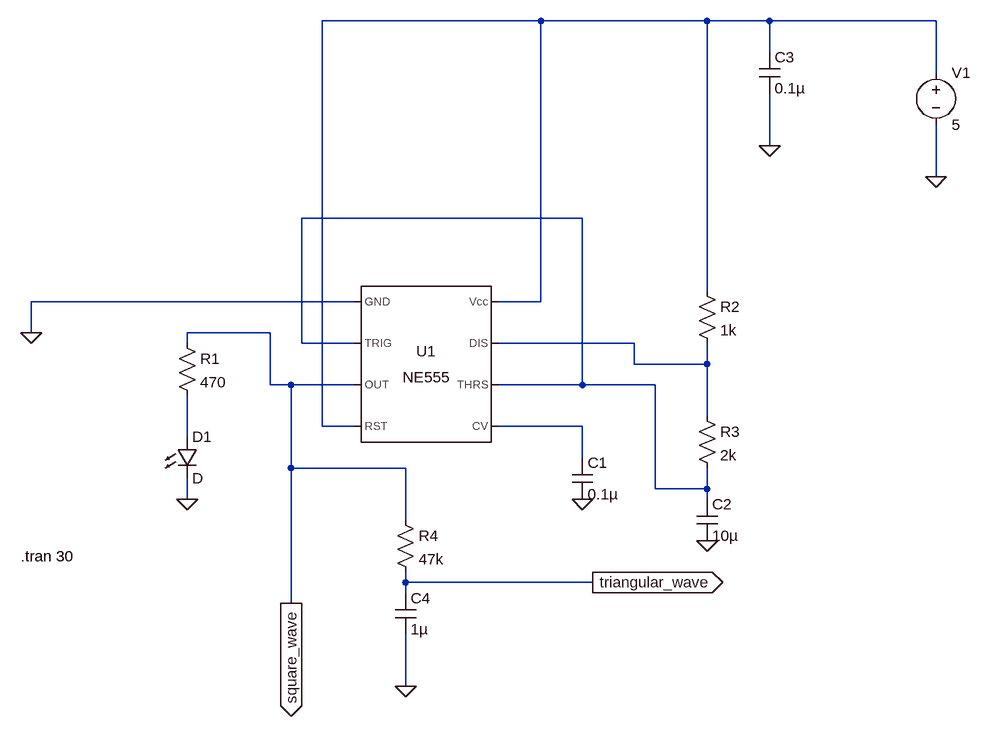
[diagram p0: schematic lic_project.asc]
lic_project.asc, the LTspice schematic file:
Version 4.1
SHEET 1 1064 776
WIRE 400 -336 64 -336
WIRE 656 -336 400 -336
WIRE 752 -336 656 -336
WIRE 1008 -336 752 -336
WIRE 752 -288 752 -336
WIRE 1008 -256 1008 -336
WIRE 752 -144 752 -224
WIRE 1008 -96 1008 -176
WIRE 464 -32 32 -32
WIRE 656 80 656 -336
WIRE 112 96 -384 96
WIRE 400 96 400 -336
WIRE 400 96 336 96
WIRE -384 144 -384 96
WIRE -16 144 -144 144
WIRE -144 160 -144 144
WIRE 32 160 32 -32
WIRE 112 160 32 160
WIRE 544 160 336 160
WIRE 544 192 544 160
WIRE 656 192 656 160
WIRE 656 192 544 192
WIRE -16 224 -16 144
WIRE 16 224 -16 224
WIRE 112 224 16 224
WIRE 464 224 464 -32
WIRE 464 224 336 224
WIRE 576 224 464 224
WIRE 656 272 656 192
WIRE 64 288 64 -336
WIRE 112 288 64 288
WIRE 464 288 336 288
WIRE -144 304 -144 240
WIRE 464 336 464 288
WIRE 16 352 16 224
WIRE 192 352 16 352
WIRE 576 384 576 224
WIRE 656 384 656 352
WIRE 656 384 576 384
WIRE -144 400 -144 368
WIRE 656 400 656 384
WIRE 192 432 192 352
WIRE 192 528 192 512
WIRE 480 528 192 528
WIRE 192 544 192 528
WIRE 16 560 16 352
WIRE 192 688 192 608
FLAG -144 400 0
FLAG -384 144 0
FLAG 1008 -96 0
FLAG 752 -144 0
FLAG 656 464 0
FLAG 464 400 0
FLAG 16 560 square_wave
IOPIN 16 560 Out
FLAG 192 688 0
FLAG 480 528 triangular_wave
IOPIN 480 528 Out
SYMBOL Misc\\NE555 224 192 R0
SYMATTR InstName U1
SYMBOL res -160 144 R0
SYMATTR InstName R1
SYMATTR Value 470
SYMBOL res 640 64 R0
SYMATTR InstName R2
SYMATTR Value 1k
SYMBOL res 640 256 R0
SYMATTR InstName R3
SYMATTR Value 2k
SYMBOL LED -160 304 R0
SYMATTR InstName D1
SYMBOL cap 448 336 R0
SYMATTR InstName C1
SYMATTR Value 0.1µ
SYMBOL cap 640 400 R0
SYMATTR InstName C2
SYMATTR Value 10µ
SYMBOL cap 736 -288 R0
SYMATTR InstName C3
SYMATTR Value 0.1µ
SYMBOL voltage 1008 -272 R0
WINDOW 123 0 0 Left 0
WINDOW 39 0 0 Left 0
SYMATTR InstName V1
SYMATTR Value 5
SYMBOL res 176 416 R0
SYMATTR InstName R4
SYMATTR Value 47k
SYMBOL cap 176 544 R0
SYMATTR InstName C4
SYMATTR Value 1µ
TEXT -400 488 Left 2 !.tran 30

The netlist it stands for:
* lic_project.asc
X§U1 0 N002 square_wave N001 N004 N002 N003 N001 NE555  ; pins GND TRIG OUT RST CV THRS DIS Vcc
R1 square_wave N005 470
R2 N001 N003 1k
R3 N003 N002 2k
D1 N005 0 D
C1 N004 0 0.1µ
C2 N002 0 10µ
C3 N001 0 0.1µ
V1 N001 0 5
R4 square_wave triangular_wave 47k
C4 triangular_wave 0 1µ
.model D D
.lib standard.dio
.tran 30
.lib NE555.sub
.backanno
.end